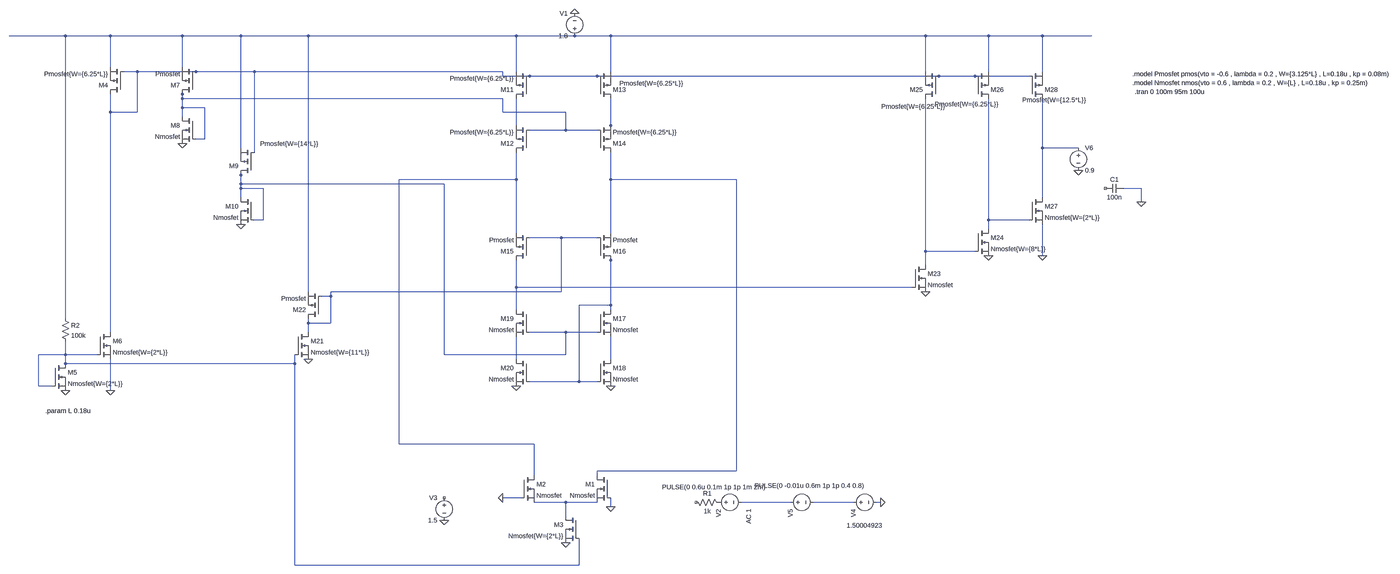
[diagram p0: schematic phase2.asc, whole sheet]
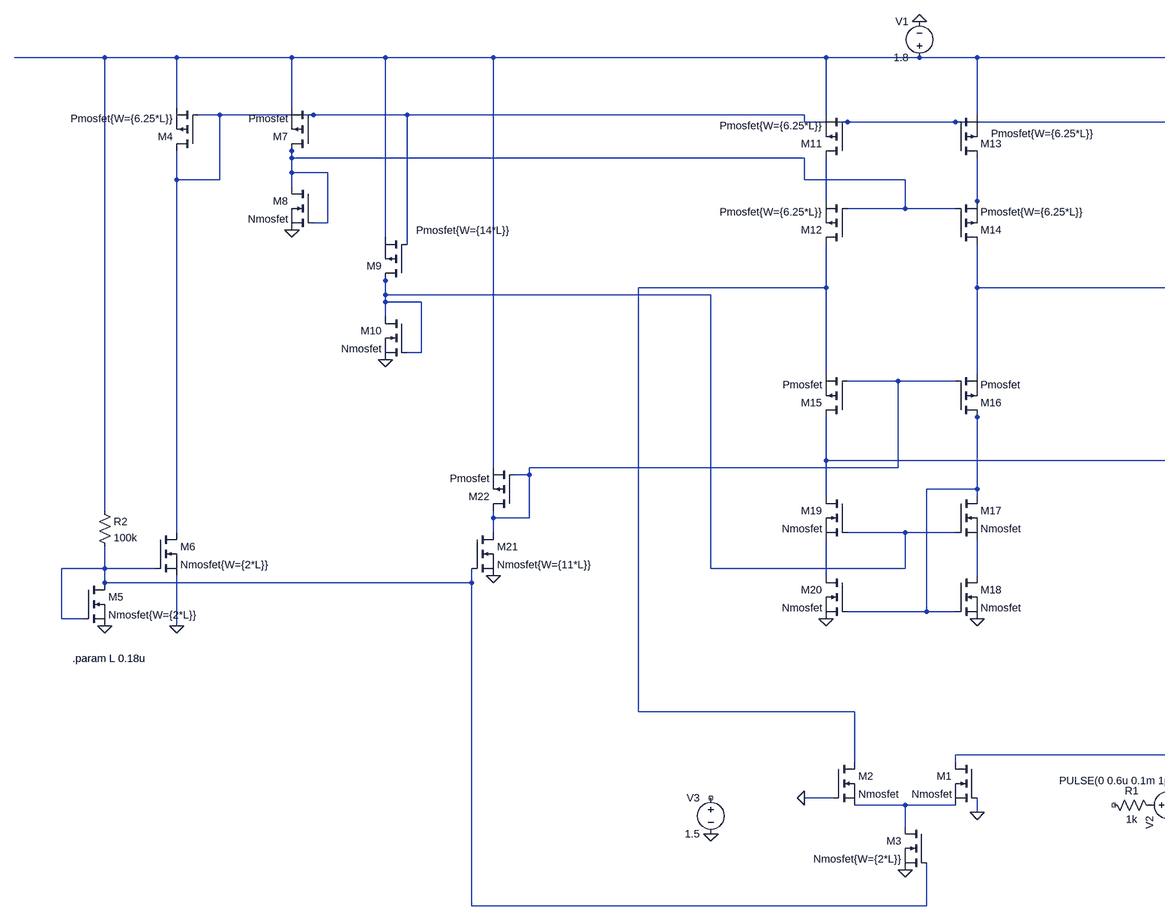
[diagram p1: schematic phase2.asc, part, row 1 of 1, column 1 of 2]
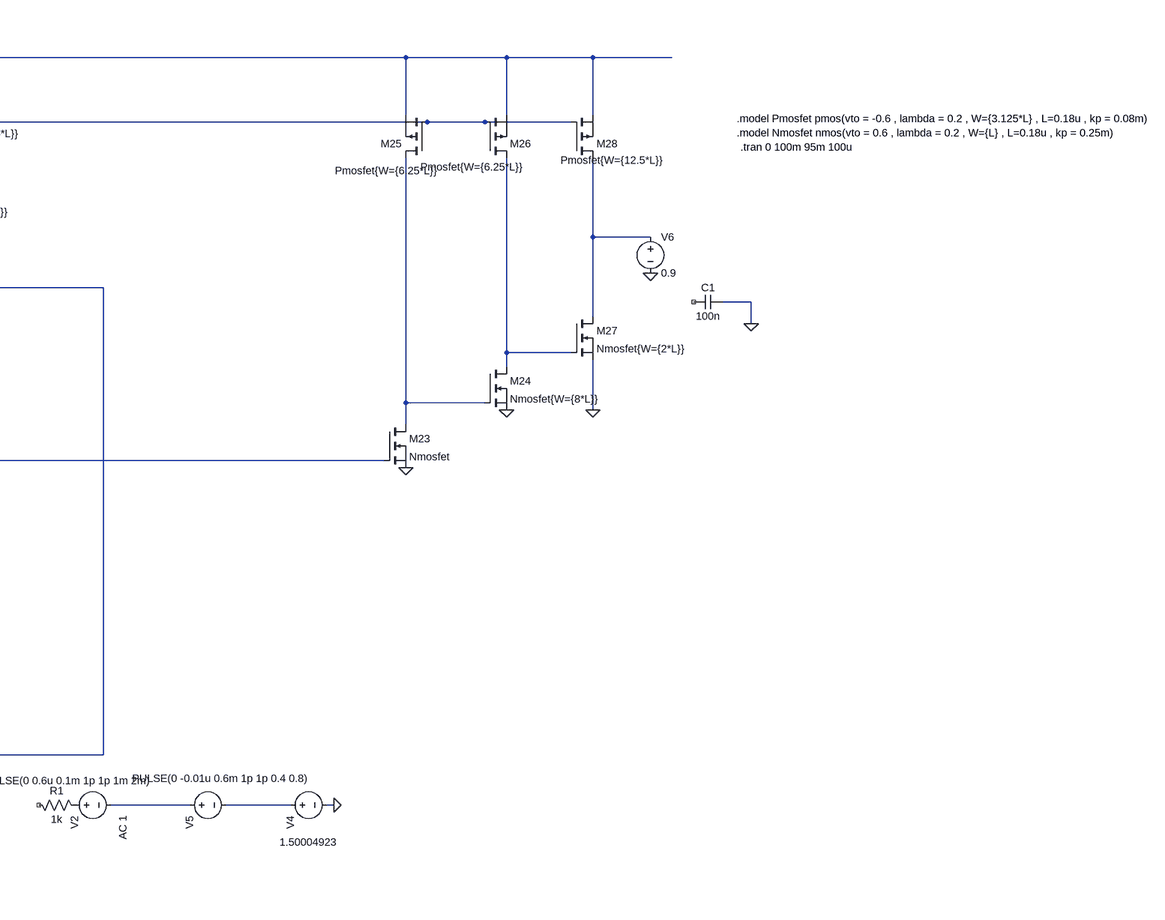
[diagram p2: schematic phase2.asc, part, row 1 of 1, column 2 of 2]
phase2.asc, the LTspice schematic file:
Version 4
SHEET 1 3152 2628
WIRE -1936 16 -2192 16
WIRE -1776 16 -1936 16
WIRE -1520 16 -1776 16
WIRE -1312 16 -1520 16
WIRE -1072 16 -1312 16
WIRE -64 16 -1072 16
WIRE 144 16 -64 16
WIRE 272 16 144 16
WIRE 1392 16 272 16
WIRE 1616 16 1392 16
WIRE 1808 16 1616 16
WIRE 1984 16 1808 16
WIRE -1776 144 -1776 16
WIRE -1520 144 -1520 16
WIRE -1680 160 -1728 160
WIRE -1472 160 -1680 160
WIRE -1264 160 -1472 160
WIRE -112 160 -1264 160
WIRE -64 160 -64 16
WIRE 272 160 272 16
WIRE 1392 160 1392 16
WIRE 1616 160 1616 16
WIRE 1808 160 1808 16
WIRE -112 176 -112 160
WIRE -16 176 -112 176
WIRE 224 176 -16 176
WIRE 1440 176 224 176
WIRE 1568 176 1440 176
WIRE 1760 176 1568 176
WIRE -1520 240 -1520 224
WIRE -1520 256 -1520 240
WIRE -112 256 -1520 256
WIRE -1520 288 -1520 256
WIRE -1440 288 -1520 288
WIRE -1776 304 -1776 240
WIRE -1680 304 -1680 160
WIRE -1680 304 -1776 304
WIRE -112 304 -112 256
WIRE 112 304 -112 304
WIRE -1520 320 -1520 288
WIRE -64 352 -64 256
WIRE 272 352 272 256
WIRE 112 368 112 304
WIRE 112 368 -16 368
WIRE 224 368 112 368
WIRE 272 368 272 352
WIRE -1440 400 -1440 288
WIRE -1440 400 -1472 400
WIRE -1312 432 -1312 16
WIRE 1808 432 1808 256
WIRE 1936 432 1808 432
WIRE -1264 448 -1264 160
WIRE -1312 528 -1312 512
WIRE -64 544 -64 448
WIRE -64 544 -576 544
WIRE 272 544 272 448
WIRE 720 544 272 544
WIRE -1312 560 -1312 528
WIRE -320 560 -1312 560
WIRE -1312 576 -1312 560
WIRE -1232 576 -1312 576
WIRE 2160 576 2096 576
WIRE -1312 608 -1312 576
WIRE 1808 608 1808 432
WIRE 2160 624 2160 576
WIRE -1232 688 -1232 576
WIRE -1232 688 -1264 688
WIRE 1616 688 1616 256
WIRE 1760 688 1616 688
WIRE 1616 720 1616 688
WIRE -64 736 -64 544
WIRE 272 736 272 544
WIRE 96 752 -16 752
WIRE 224 752 96 752
WIRE 1392 800 1392 256
WIRE 1568 800 1392 800
WIRE 1808 816 1808 704
WIRE 272 832 272 816
WIRE 1392 848 1392 800
WIRE -64 928 -64 832
WIRE 1344 928 -64 928
WIRE -1072 944 -1072 16
WIRE 96 944 96 752
WIRE 96 944 -992 944
WIRE -992 960 -992 944
WIRE -992 960 -1024 960
WIRE 272 992 272 832
WIRE 272 992 160 992
WIRE -64 1008 -64 928
WIRE 272 1008 272 992
WIRE -1936 1040 -1936 16
WIRE -1072 1056 -1072 1040
WIRE -992 1056 -992 960
WIRE -992 1056 -1072 1056
WIRE -1776 1088 -1776 304
WIRE -1072 1088 -1072 1056
WIRE 112 1088 -16 1088
WIRE 224 1088 112 1088
WIRE -1936 1168 -1936 1120
WIRE -1936 1168 -2032 1168
WIRE -1824 1168 -1936 1168
WIRE -320 1168 -320 560
WIRE 112 1168 112 1088
WIRE 112 1168 -320 1168
WIRE -64 1184 -64 1104
WIRE 272 1184 272 1104
WIRE -1936 1200 -1936 1168
WIRE -1120 1200 -1120 1168
WIRE -1120 1200 -1936 1200
WIRE 160 1264 160 992
WIRE 160 1264 -16 1264
WIRE 224 1264 160 1264
WIRE -2032 1280 -2032 1168
WIRE -1984 1280 -2032 1280
WIRE -1776 1296 -1776 1184
WIRE -576 1648 -576 544
WIRE 0 1648 -576 1648
WIRE 720 1744 720 544
WIRE 720 1744 224 1744
WIRE 0 1760 0 1648
WIRE 224 1760 224 1744
WIRE -48 1840 -112 1840
WIRE 112 1856 0 1856
WIRE 224 1856 112 1856
WIRE 912 1856 736 1856
WIRE 1136 1856 992 1856
WIRE 1232 1856 1216 1856
WIRE 272 1872 272 1840
WIRE 112 1904 112 1856
WIRE -1120 2080 -1120 1200
WIRE 160 2080 160 1984
WIRE 160 2080 -1120 2080
FLAG 144 -64 0
FLAG 272 1280 0
FLAG -64 1280 0
FLAG 112 2000 0
FLAG -320 1920 0
FLAG 1232 1856 0
FLAG -1776 1296 0
FLAG -1936 1296 0
FLAG -1072 1184 0
FLAG -1520 416 0
FLAG -1312 704 0
FLAG 1616 816 0
FLAG 1392 944 0
FLAG 2160 624 0
FLAG 1808 816 0
FLAG 272 1872 0
FLAG -112 1840 0
FLAG 1936 512 0
SYMBOL voltage 144 32 R180
WINDOW 0 24 96 Left 2
WINDOW 3 24 16 Left 2
WINDOW 123 0 0 Left 0
WINDOW 39 0 0 Left 0
SYMATTR InstName V1
SYMATTR Value 1.8
SYMBOL pmos -16 256 R180
SYMATTR InstName M11
SYMATTR Value Pmosfet{W={6.25*L}}
SYMBOL pmos -16 448 R180
SYMATTR InstName M12
SYMATTR Value Pmosfet{W={6.25*L}}
SYMBOL pmos 224 256 M180
WINDOW 3 79 54 Left 2
SYMATTR Value Pmosfet{W={6.25*L}}
SYMATTR InstName M13
SYMBOL pmos 224 448 M180
SYMATTR InstName M14
SYMATTR Value Pmosfet{W={6.25*L}}
SYMBOL pmos -16 832 R180
SYMATTR InstName M15
SYMATTR Value Pmosfet
SYMBOL pmos 224 832 M180
SYMATTR InstName M16
SYMATTR Value Pmosfet
SYMBOL nmos 224 1008 R0
SYMATTR InstName M17
SYMATTR Value Nmosfet
SYMBOL nmos 224 1184 R0
SYMATTR InstName M18
SYMATTR Value Nmosfet
SYMBOL nmos -16 1008 M0
SYMATTR InstName M19
SYMATTR Value Nmosfet
SYMBOL nmos -16 1184 M0
SYMATTR InstName M20
SYMATTR Value Nmosfet
SYMBOL nmos 272 1760 M0
SYMATTR InstName M1
SYMATTR Value Nmosfet
SYMBOL nmos -48 1760 R0
SYMATTR InstName M2
SYMATTR Value Nmosfet
SYMBOL nmos 160 1904 M0
SYMATTR InstName M3
SYMATTR Value Nmosfet{W={2*L}}
SYMBOL res 560 1840 M90
WINDOW 0 0 56 VBottom 2
WINDOW 3 32 56 VTop 2
SYMATTR InstName R1
SYMATTR Value 1k
SYMBOL voltage 640 1856 M90
WINDOW 123 24 124 Left 2
WINDOW 39 0 0 Left 0
WINDOW 3 -54 -185 VRight 2
SYMATTR Value2 AC 1
SYMATTR Value PULSE(0 0.6u 0.1m 1p 1p 1m 2m)
SYMATTR InstName V2
SYMBOL voltage -320 1824 M0
WINDOW 123 0 0 Left 0
WINDOW 39 0 0 Left 0
SYMATTR InstName V3
SYMATTR Value 1.5
SYMBOL voltage 1120 1856 M90
WINDOW 123 0 0 Left 0
WINDOW 39 0 0 Left 0
WINDOW 3 82 -9 VRight 2
SYMATTR Value 1.50004923
SYMATTR InstName V4
SYMBOL voltage 896 1856 M90
WINDOW 123 0 0 Left 0
WINDOW 39 0 0 Left 0
WINDOW 3 -59 -112 VRight 2
SYMATTR Value PULSE(0 -0.01u 0.6m 1p 1p 0.4 0.8)
SYMATTR InstName V5
SYMBOL pmos -1728 240 R180
SYMATTR InstName M4
SYMATTR Value Pmosfet{W={6.25*L}}
SYMBOL nmos -1984 1200 R0
SYMATTR InstName M5
SYMATTR Value Nmosfet{W={2*L}}
SYMBOL res -1952 1024 R0
SYMATTR InstName R2
SYMATTR Value 100k
SYMBOL nmos -1824 1088 R0
SYMATTR InstName M6
SYMATTR Value Nmosfet{W={2*L}}
SYMBOL pmos -1472 240 R180
SYMATTR InstName M7
SYMATTR Value Pmosfet
SYMBOL nmos -1472 320 M0
SYMATTR InstName M8
SYMATTR Value Nmosfet
SYMBOL pmos -1264 528 R180
WINDOW 3 -228 111 Left 2
SYMATTR Value Pmosfet{W={14*L}}
SYMATTR InstName M9
SYMBOL nmos -1264 608 M0
SYMATTR InstName M10
SYMATTR Value Nmosfet
SYMBOL nmos -1120 1088 R0
SYMATTR InstName M21
SYMATTR Value Nmosfet{W={11*L}}
SYMBOL pmos -1024 1040 R180
SYMATTR InstName M22
SYMATTR Value Pmosfet
SYMBOL nmos 1344 848 R0
SYMATTR InstName M23
SYMATTR Value Nmosfet
SYMBOL nmos 1568 720 R0
SYMATTR InstName M24
SYMATTR Value Nmosfet{W={8*L}}
SYMBOL pmos 1440 256 R180
WINDOW 3 -23 -28 Left 2
SYMATTR Value Pmosfet{W={6.25*L}}
SYMATTR InstName M25
SYMBOL pmos 1568 256 M180
WINDOW 3 -143 -20 Left 2
SYMATTR Value Pmosfet{W={6.25*L}}
SYMATTR InstName M26
SYMBOL cap 2096 560 R90
WINDOW 0 0 32 VBottom 2
WINDOW 3 32 32 VTop 2
SYMATTR InstName C1
SYMATTR Value 100n
SYMBOL nmos 1760 608 R0
SYMATTR InstName M27
SYMATTR Value Nmosfet{W={2*L}}
SYMBOL pmos 1760 256 M180
WINDOW 3 -24 -5 Left 2
SYMATTR Value Pmosfet{W={12.5*L}}
SYMATTR InstName M28
SYMBOL voltage 1936 416 R0
WINDOW 123 0 0 Left 0
WINDOW 39 0 0 Left 0
SYMATTR InstName V6
SYMATTR Value 0.9
TEXT -2008 1368 Left 2 !.param L 0.18u
TEXT 2128 168 Left 2 !.model Pmosfet pmos(vto = -0.6 , lambda = 0.2 , W={3.125*L} , L=0.18u , kp = 0.08m)
TEXT 2128 200 Left 2 !.model Nmosfet nmos(vto = 0.6 , lambda = 0.2 , W={L} , L=0.18u , kp = 0.25m)
TEXT 2136 232 Left 2 !.tran 0 100m 95m 100u

The netlist it stands for:
* phase2.asc
V1 N001 0 1.8
M11 N004 N002 N001 N001 Pmosfet{W={6.25*L}}
M12 N008 N003 N004 N004 Pmosfet{W={6.25*L}}
M13 N005 N002 N001 N001 Pmosfet{W={6.25*L}}
M14 N009 N003 N005 N005 Pmosfet{W={6.25*L}}
M15 N014 N011 N008 N008 Pmosfet
M16 N013 N011 N009 N009 Pmosfet
M17 N013 N007 N017 N017 Nmosfet
M18 N017 N013 0 0 Nmosfet
M19 N014 N007 N016 N016 Nmosfet
M20 N016 N013 0 0 Nmosfet
M1 N009 0 N018 N018 Nmosfet
M2 N008 0 N018 N018 Nmosfet
M3 N018 N015 0 0 Nmosfet{W={2*L}}
R1 NC_01 P001 1k
V2 P001 N019 PULSE(0 0.6u 0.1m 1p 1p 1m 2m) AC 1
V3 NC_02 0 1.5
V4 N020 0 1.50004923
V5 N019 N020 PULSE(0 -0.01u 0.6m 1p 1p 0.4 0.8)
M4 N002 N002 N001 N001 Pmosfet{W={6.25*L}}
M5 N015 N015 0 0 Nmosfet{W={2*L}}
R2 N001 N015 100k
M6 N002 N015 0 0 Nmosfet{W={2*L}}
M7 N003 N002 N001 N001 Pmosfet
M8 N003 N003 0 0 Nmosfet
M9 N007 N002 N001 N001 Pmosfet{W={14*L}}
M10 N007 N007 0 0 Nmosfet
M21 N011 N015 0 0 Nmosfet{W={11*L}}
M22 N011 N011 N001 N001 Pmosfet
M23 N012 N014 0 0 Nmosfet
M24 N010 N012 0 0 Nmosfet{W={8*L}}
M25 N012 N002 N001 N001 Pmosfet{W={6.25*L}}
M26 N010 N002 N001 N001 Pmosfet{W={6.25*L}}
C1 0 NC_03 100n
M27 N006 N010 0 0 Nmosfet{W={2*L}}
M28 N006 N002 N001 N001 Pmosfet{W={12.5*L}}
V6 N006 0 0.9
.model NMOS NMOS
.model PMOS PMOS
.lib standard.mos
.param L 0.18u
.model Pmosfet pmos(vto = -0.6 , lambda = 0.2 , W={3.125*L} , L=0.18u , kp = 0.08m)
.model Nmosfet nmos(vto = 0.6 , lambda = 0.2 , W={L} , L=0.18u , kp = 0.25m)
.tran 0 100m 95m 100u
.backanno
.end